# Altium schematic sheet 03_nRF52840_RF.SchDoc
size 420 x 297 mm; Author: Shpakov Dmitry; Address1: Address1; Address2: Address2; Address3: Address3; Address4: Address4; DocumentNumber: АБВГ.123456.001 Э3; SheetNumber: 4; SheetTotal: 13; Scale: 1:1; DocumentType: Схема электрическая принципиальная; FirstReferrence: АБВГ.123456.001
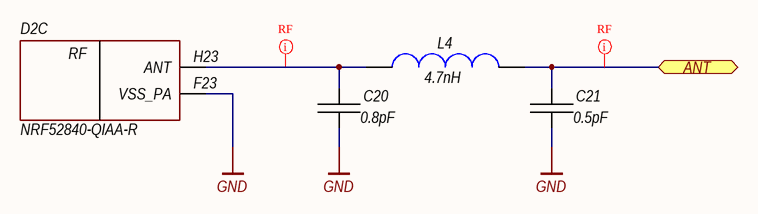
[diagram p0: 03_nRF52840_RF.SchDoc]

## Parts
C20  0.8pF  [CAPC1608X09N]
C21  0.5pF  [CAPC1608X09N]
D2  NRF52840-QIAA-R  [AQFN50P700X700X85_HS-74N]  (part C of 9)
L4  4.7nH  [INDC1608X08N]

## Ports
ANT

## Nets
GND: C20.1 C21.1 D2.F23(VSS_PA)
ANT: C21.2 L4.2 ; port ANT
NetC20_2: C20.2 D2.H23(ANT) L4.1

## Layout directives
rule Undefined: ANT, NetC20_2

## Notes on the sheet
- Author
- Manufacturer
- Date
- Page
- Total pages
- Size page
- A3
- Materials
- (in symbol nRF52840-QFN373, part C) RF

## Library data of the parts
C20 = Ceramic: Ceramic capacitor; Manufacturer: Murata Electronics; PartNumber: GQM1875C2ER80BB12D; Power/Voltage: 250V; Tolerance: 0.1pF; Operation Temperature: -55...+125; Help URL: https://www.digikey.com/en/products/detail/murata-electronics/GQM1875C2ER80BB12D/11618603; Type: capacitor; Value: 0.8pF; Note: *; Case: 0603
C21 = Ceramic: Ceramic capacitor; Manufacturer: Murata Electronics; PartNumber: GQM1875C2ER50WB12D; Power/Voltage: 250V; Tolerance: 0.05pF; Operation Temperature: -55...+125; Help URL: https://www.digikey.com/en/products/detail/murata-electronics/GQM1875C2ER50WB12D/11618602; Type: capacitor; Value: 0.5pF; Note: *; Case: 0603
D2 = nRF52840-QFN373: IC RF TxRx + MCU 802.15.4, Bluetooth Bluetooth v5.0 2.4GHz 73-VFQFN Dual Rows, Exposed Pad; Manufacturer: Nordic Semiconductor ASA; Power/Voltage: 1.7V ~ 5.5V; Operation Temperature: -40...+85; Help URL: https://www.digikey.com/en/products/detail/nexperia-usa-inc/2N7002-215/762973; Type: IC RF TXRX+MCU 802.15.4; Value: *; Tolerance: *; Note: *; Case: 73-aQFN (7x7); PartNumber: NRF52840-QIAA-R
L4 = Inductor: Manufacturer: AVX Corporation; PartNumber: L06034R7CGSTR; Tolerance: 0.2nH; Operation Temperature: -55...+125; Maximum DC Current: 500mA; Maximum DC Resistance: 150 mOhm; Q @ freq: 23 @ 450MHz; Frequency self resonant: 5.5GHz; Help URL: https://www.digikey.com/en/products/detail/avx-corporation/L06034R7CGSTR/1531806; Power/Voltage: *; Type: inductor; Value: 4.7nH; Note: *; Case: 0603; Saturation Current: *